# Altium project LED-IBUS-FSI6.PrjPCB
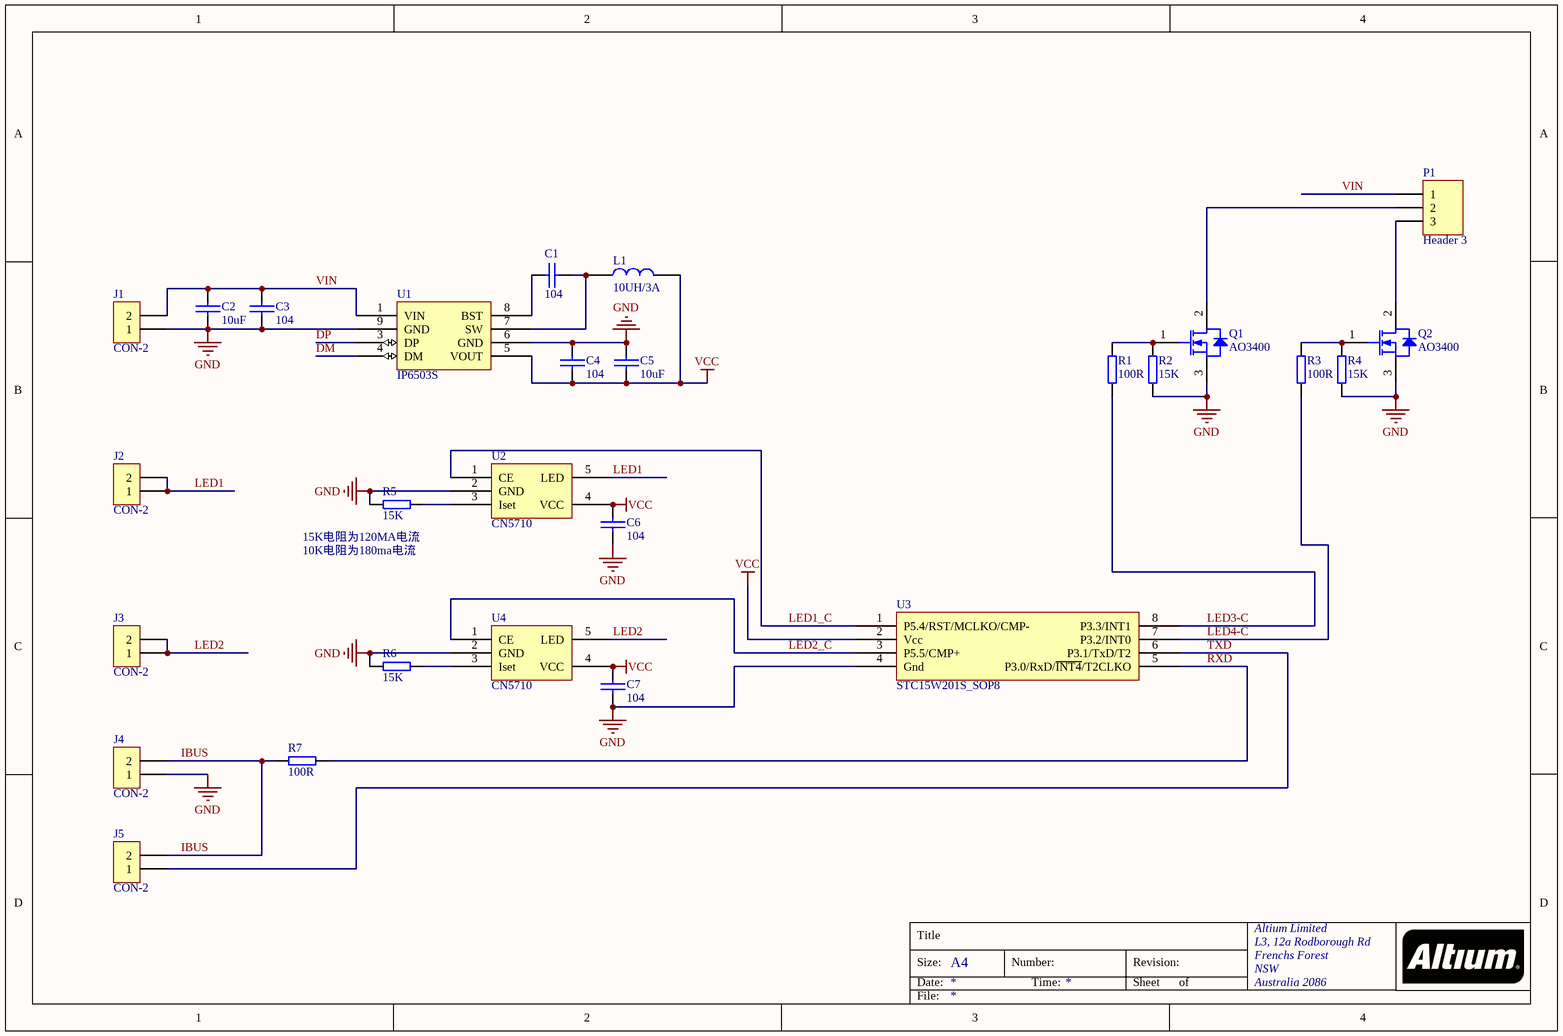
[diagram p0: FSI6-LED-IBUS.SchDoc]
1 sheet, 27 parts. Net scope: global (net labels, ports and power ports of the same name join across sheets).
Board file: IBUS_Led.PcbDoc

## Sheet FSI6-LED-IBUS.SchDoc
size A4; Organization: Altium Limited; Address1: L3, 12a Rodborough Rd; Address2: Frenchs Forest; Address3: NSW; Address4: Australia 2086

### Parts
C1  104  [0603]
C2  10uF  [0805]
C3  104  [0603]
C4  104  [0603]
C5  10uF  [0805]
C6  104  [0603]
C7  104  [0603]
J1  CON-2  [2EDG5.08V-2P]
J2  CON-2  [SIP2]
J3  CON-2  [SIP2]
J4  CON-2  [SIP2]
J5  CON-2  [SIP2]
L1  10UH/3A  [CD75]
P1  Header 3  [HDR1X3]
Q1  AO3400  [SOT-23N]
Q2  AO3400  [SOT-23N]
R1  100R  [0603]
R2  15K  [0603]
R3  100R  [0603]
R4  15K  [0603]
R5  15K  [0603]
R6  15K  [0603]
R7  100R  [0603]
U1  IP6503S  [ESOP-8]
U2  CN5710  [SOT-89-5]
U3  STC15W201S_SOP8  [SOP8]
U4  CN5710  [SOT-89-5]

### Nets
GND: C2.2 C3.1 C4.1 C5.1 C6.2 C7.2 J1.1 J4.1 Q1.3(S) Q2.3(S) R2.1 R4.2 R5.1 R6.2 U1.6(GND) U1.9(GND) U2.2(GND) U3.4(Gnd) U4.2(GND)
VCC: C4.2 C5.2 C6.1 C7.1 L1.2 U1.5(VOUT) U2.4(VCC) U3.2(Vcc) U4.4(VCC)
DM: U1.4(DM)
DP: U1.3(DP)
IBUS: J4.2 J5.2 R7.2
LED1: J2.1 J2.2 U2.5(LED)
LED1_C: U2.1(CE) U3.1(P5.4/RST/MCLKO/CMP-)
LED2: J3.1 J3.2 U4.5(LED)
LED2_C: U3.3(P5.5/CMP+) U4.1(CE)
LED3-C: R1.1 U3.8(P3.3/INT1)
LED4-C: R3.2 U3.7(P3.2/INT0)
RXD: R7.1 U3.5(P3.0/RxD/~{INT4}/T2CLKO)
TXD: J5.1 U3.6(P3.1/TxD/T2)
VIN: C2.1 C3.2 J1.2 P1.1 U1.1(VIN)
NetC1_1: C1.1 L1.1 U1.7(SW)
NetC1_2: C1.2 U1.8(BST)
NetP1_2: P1.2 Q1.2(D)
NetP1_3: P1.3 Q2.2(D)
NetQ1_1: Q1.1(G) R1.2 R2.2
NetQ2_1: Q2.1(G) R3.1 R4.1
NetR5_2: R5.2 U2.3(Iset)
NetR6_1: R6.1 U4.3(Iset)

Not connected (* = marked no-connect by the designer): U1 2(NC)

### Notes on the sheet
- (near R5) 15K电阻为120MA电流
- (near R5) 10K电阻为180ma电流
- Title
- Size:
- Date:
- A4
- Number:
- Time:
- Revision:
- Sheet
- of
- File:

### Library data of the parts
C1-C7 = C
L1 = IND
P1 = Header 3: Header, 3-Pin; LatestRevisionDate: 17-Jul-2002; LatestRevisionNote: Re-released for DXP Platform.; Publisher: Altium Limited
Q1 Q2 = MOS-N: N-Channel MOSFET; Published: 8-Jun-2000; LatestRevisionDate: 17-Jul-2002; LatestRevisionNote: Re-released for DXP Platform.; PackageVersion: 1995/1996; PackageReference: E3; Publisher: Altium Limited
R1-R7 = R: Res1